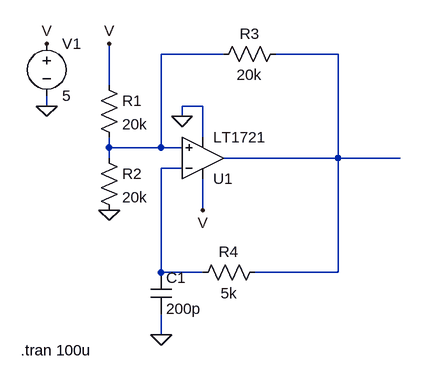
[diagram p0: schematic RelaxationOscillator_SquareWaveGen.asc]
RelaxationOscillator_SquareWaveGen.asc, the LTspice schematic file:
Version 4.1
SHEET 1 1188 712
WIRE 576 240 480 240
WIRE 752 240 656 240
WIRE 400 288 400 224
WIRE 304 320 304 304
WIRE 544 320 512 320
WIRE 512 336 512 320
WIRE 544 368 544 320
WIRE 400 384 400 368
WIRE 480 384 480 240
WIRE 480 384 400 384
WIRE 512 384 480 384
WIRE 400 400 400 384
WIRE 752 400 752 240
WIRE 752 400 576 400
WIRE 848 400 752 400
WIRE 512 416 480 416
WIRE 544 480 544 432
WIRE 480 576 480 416
WIRE 544 576 480 576
WIRE 752 576 752 400
WIRE 752 576 624 576
WIRE 480 672 480 640
FLAG 512 336 0
FLAG 304 320 0
FLAG 544 480 V
FLAG 304 224 V
FLAG 400 480 0
FLAG 400 224 V
FLAG 480 672 0
SYMBOL cap 464 576 R0
SYMATTR InstName C1
SYMATTR Value 200p
SYMBOL voltage 304 208 R0
WINDOW 123 0 0 Left 0
WINDOW 39 0 0 Left 0
SYMATTR InstName V1
SYMATTR Value 5
SYMBOL res 384 272 R0
SYMATTR InstName R1
SYMATTR Value 20k
SYMBOL res 384 384 R0
SYMATTR InstName R2
SYMATTR Value 20k
SYMBOL res 672 224 R90
WINDOW 0 0 56 VBottom 2
WINDOW 3 32 56 VTop 2
SYMATTR InstName R3
SYMATTR Value 20k
SYMBOL res 640 560 R90
WINDOW 0 0 56 VBottom 2
WINDOW 3 32 56 VTop 2
SYMATTR InstName R4
SYMATTR Value 5k
SYMBOL Comparators\\LT1721 544 464 M180
SYMATTR InstName U1
TEXT 264 696 Left 2 !.tran 100u

The netlist it stands for:
* RelaxationOscillator_SquareWaveGen.asc
C1 N003 0 200p
V1 V 0 5
R1 V N001 20k
R2 N001 0 20k
R3 N002 N001 20k
R4 N002 N003 5k
X§U1 N001 N003 V 0 N002 LT1720  ; LT1721, pins In+ In- V+ V- OUT
.tran 100u
.lib LTC.lib
.backanno
.end